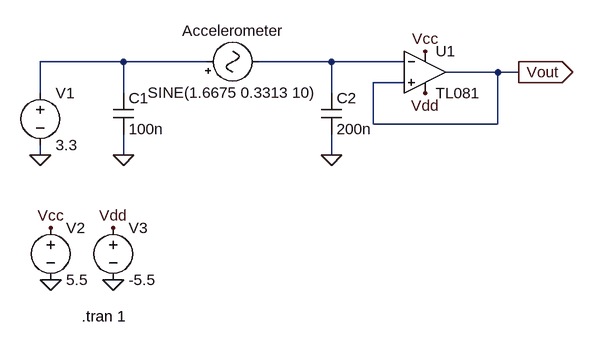
[diagram p0: schematic Accelerometer.asc]
Accelerometer.asc, the LTspice schematic file:
Version 4
SHEET 1 1080 744
WIRE 352 336 224 336
WIRE 480 336 352 336
WIRE 672 336 560 336
WIRE 784 336 672 336
WIRE 928 352 848 352
WIRE 960 352 928 352
WIRE 784 368 736 368
WIRE 224 384 224 336
WIRE 352 384 352 336
WIRE 672 384 672 336
WIRE 736 432 736 368
WIRE 928 432 928 352
WIRE 928 432 736 432
WIRE 224 480 224 464
WIRE 352 480 352 448
WIRE 672 480 672 448
FLAG 672 480 0
FLAG 352 480 0
FLAG 224 480 0
FLAG 816 320 Vcc
FLAG 336 672 0
FLAG 240 672 0
FLAG 240 592 Vcc
FLAG 336 592 Vdd
FLAG 816 384 Vdd
FLAG 960 352 Vout
IOPIN 960 352 Out
SYMBOL Misc/signal 464 336 R270
WINDOW 0 32 56 VTop 2
WINDOW 3 -32 56 VBottom 2
WINDOW 123 0 0 Left 2
WINDOW 39 0 0 Left 2
SYMATTR InstName Accelerometer
SYMATTR Value SINE(1.6675 0.3313 10)
SYMBOL cap 656 384 R0
SYMATTR InstName C2
SYMATTR Value 200n
SYMBOL cap 336 384 R0
SYMATTR InstName C1
SYMATTR Value 100n
SYMBOL voltage 224 368 R0
SYMATTR InstName V1
SYMATTR Value 3.3
SYMBOL TL081 816 288 R0
SYMATTR InstName U1
SYMBOL voltage 240 576 R0
SYMATTR InstName V2
SYMATTR Value 5.5
SYMBOL voltage 336 576 R0
SYMATTR InstName V3
SYMATTR Value -5.5
TEXT 288 728 Left 2 !.tran 1

The netlist it stands for:
* Accelerometer.asc
V§Accelerometer N001 N002 SINE(1.6675 0.3313 10)
C2 N002 0 200n
C1 N001 0 100n
V1 N001 0 3.3
* U1: TL081 (symbol TL081 not available, pins judged from their places): In+=Vout In-=N002 V+=Vcc V-=Vdd OUT=Vout
V2 Vcc 0 5.5
V3 Vdd 0 -5.5
.tran 1
.backanno
.end